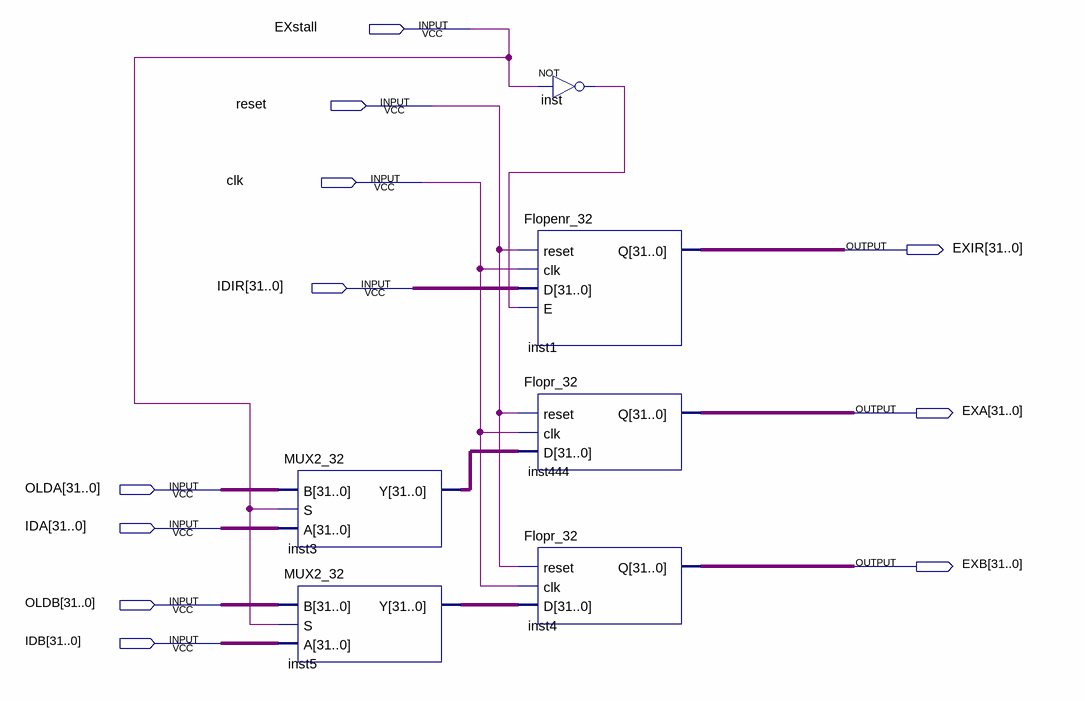
[diagram p0: schematic sheet]
// Quartus schematic IDEXTower.bdf as structural Verilog: 6 symbols, 11 pins
module IDEXTower (
  input  EXstall,
  input  reset,
  input  clk,
  input  [31:0] IDIR,
  input  [31:0] OLDA,
  input  [31:0] IDA,
  input  [31:0] OLDB,
  input  [31:0] IDB,
  output [31:0] EXIR,
  output [31:0] EXA,
  output [31:0] EXB
);

  wire inst_out;
  wire [31:0] inst3_y, inst5_y;

  MUX2_32 inst3 (.B(OLDA), .S(EXstall), .A(IDA), .Y(inst3_y));
  MUX2_32 inst5 (.B(OLDB), .S(EXstall), .A(IDB), .Y(inst5_y));
  not inst (inst_out, EXstall);
  Flopenr_32 inst1 (.reset(reset), .clk(clk), .D(IDIR), .E(inst_out), .Q(EXIR));
  Flopr_32 inst444 (.reset(reset), .clk(clk), .D(inst3_y), .Q(EXA));
  Flopr_32 inst4 (.reset(reset), .clk(clk), .D(inst5_y), .Q(EXB));
endmodule
